# Altium project ECAD_Clock.PrjPcb
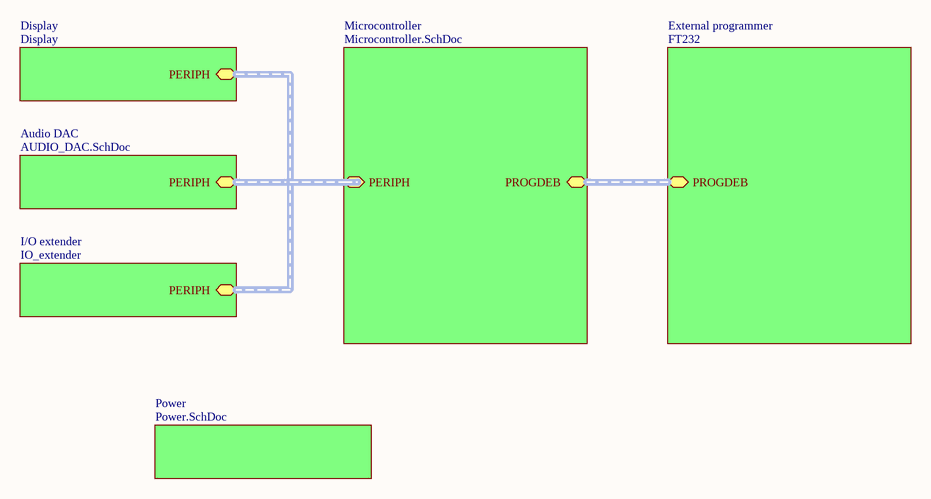
[diagram p0: Top level overview.SchDoc]
7 sheets, 117 parts. Net scope: hierarchical (ports join the sheet entries above them; power ports are global).
Board file: ECAD_Clock.PcbDoc
Sheets:
  Top level overview.SchDoc
    Microcontroller = Microcontroller.SchDoc
    External programmer = FT232.SchDoc
    Display = Display.SchDoc
    Audio DAC = AUDIO_DAC.SchDoc
    I/O extender = IO_extender.SchDoc
    Power = Power.SchDoc

## Sheet Top level overview.SchDoc
size A4

### Sub-sheets
Audio DAC = AUDIO_DAC.SchDoc: PERIPH (harness PERIPH)
Display = Display: PERIPH (harness PERIPH)
External programmer = FT232: PROGDEB (harness PROGDEB)
I/O extender = IO_extender: PERIPH (harness PERIPH)
Microcontroller = Microcontroller.SchDoc: PROGDEB (harness PROGDEB), PERIPH (harness PERIPH)
Power = Power.SchDoc: no entries

### Buses and harness runs
harness sheet Audio DAC/PERIPH = sheet Display/PERIPH = sheet I/O extender/PERIPH = sheet Microcontroller/PERIPH
harness sheet External programmer/PROGDEB = sheet Microcontroller/PROGDEB

## Sheet Microcontroller.SchDoc
size A4
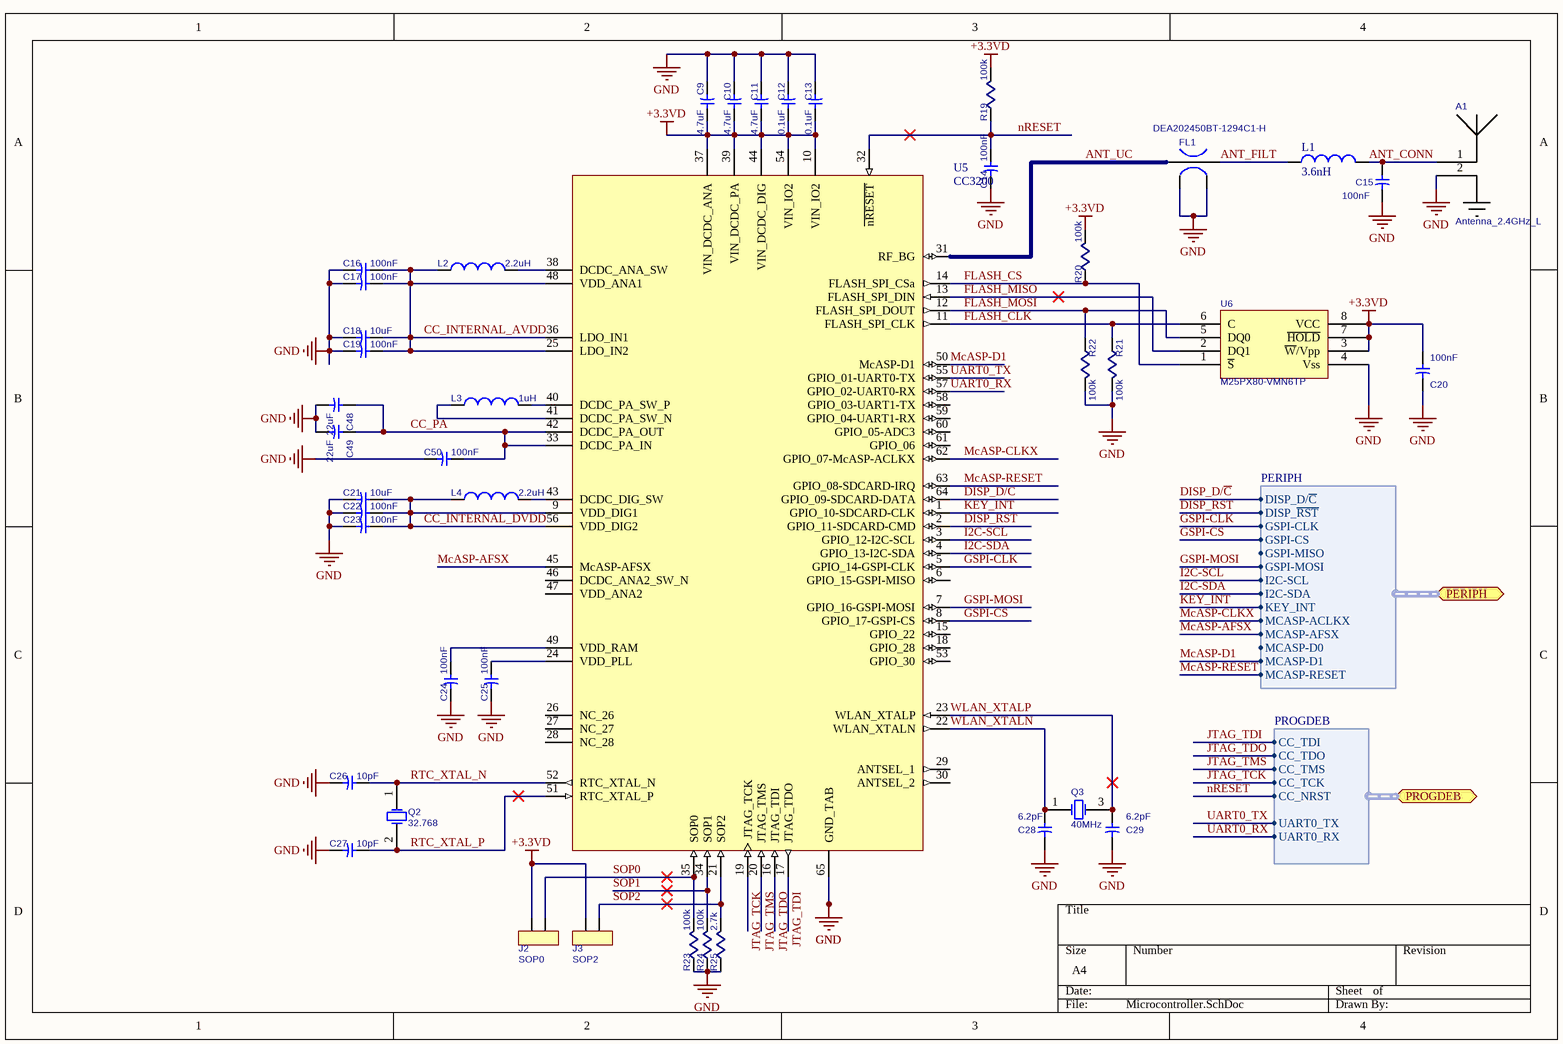
[diagram p1: Microcontroller.SchDoc]

### Parts
A1  Antenna_2.4GHz_L  [Antenna_2.45GHz_IFA1_L]  (net tie, no BOM)
C9  4.7uF  [C_0603A]
C10  4.7uF  [C_0603A]
C11  4.7uF  [C_0603A]
C12  0.1uF  [C_0603A]
C13  0.1uF  [C_0603A]
C14  100nF  [C_0603A]
C15  100nF  [C_0603A]
C16  100nF  [C_0603A]
C17  100nF  [C_0603A]
C18  10uF  [C_0603A]
C19  100nF  [C_0603A]
C20  100nF  [C_0603A]
C21  10uF  [C_0603A]
C22  100nF  [C_0603A]
C23  100nF  [C_0603A]
C24  100nF  [C_0603A]
C25  100nF  [C_0603A]
C26  10pF  [C_0603A]
C27  10pF  [C_0603A]
C28  6.2pF  [C_0603A]
C29  6.2pF  [C_0603A]
C48  22uF  [C_1210D]
C49  22uF  [C_1210D]
C50  100nF  [C_0603A]
FL1  DEA202450BT-1294C1-H  [DEA202450BT-1294C1-H]
J2  SOP0  [JUMPER100]
J3  SOP2  [JUMPER100]
L1  3.6nH  [0402-A]
L2  2.2uH  [L_1008]
L3  1uH  [L_1008]
L4  2.2uH  [L_1008]
Q2  32.768  [Q_FC135]
Q3  40MHz  [SM/25X20/CMOS_CLK_4]
R19  100k  [R_0603]
R20  100k  [R_0603]
R21  100k  [R_0603]
R22  100k  [R_0603]
R23  100k  [R_0603]
R24  100k  [R_0603]
R25  2.7k  [R_0603]
U5  CC3200  [PQFN50P900X900X100_HS-65N]
U6  M25PX80-VMN6TP  [SOG.050/8/WG.244/L.175]

### Ports
PERIPH (harness PERIPH), PROGDEB (harness PROGDEB)

### Harnesses
PROGDEB: CC_TDI, CC_TDO, CC_TCK, CC_TMS, CC_NRST, UART0_TX, UART0_RX
PERIPH: DISP_D/~{C}, DISP_~{RST}, GSPI-CLK, GSPI-CS, GSPI-MISO, GSPI-MOSI, I2C-SCL, I2C-SDA, KEY_INT, MCASP-ACLKX, MCASP-AFSX, MCASP-D0, MCASP-D1, MCASP-RESET

### Nets
+3.3VD: C9.1 C10.1 C11.1 C12.1 C13.1 C20.1 J2.1 J3.1 R19.1 R20.1 U5.10(VIN_IO2) U5.37(VIN_DCDC_ANA) U5.39(VIN_DCDC_PA) U5.44(VIN_DCDC_DIG) U5.54(VIN_IO2) U6.3(~{W}/Vpp) U6.7(~{HOLD}) U6.8(VCC)  [project net IOVDD]
GND: A1.2 C9.2 C10.2 C11.2 C12.2 C13.2 C14.2 C15.2 C16.2 C17.2 C18.2 C19.2 C20.2 C21.2 C22.2 C23.2 C24.2 C25.2 C26.2 C27.2 C28.2 C29.2 C48.2 C49.2 C50.2 FL1.2 FL1.4 Q3.2(GND) Q3.4(GND) R21.1 R22.1 R23.2 R24.2 R25.2 U5.65(GND_TAB) U6.4(Vss)
ANT_CONN: A1.1 C15.1 L1.2
ANT_FILT: FL1.3 L1.1
ANT_UC: FL1.1 U5.31(RF_BG)
CC_INTERNAL_AVDD: C16.1 C17.1 C18.1 C19.1 L2.1 U5.25(LDO_IN2) U5.36(LDO_IN1) U5.48(VDD_ANA1)
CC_INTERNAL_DVDD: C21.1 C22.1 C23.1 L4.1 U5.9(VDD_DIG1) U5.56(VDD_DIG2)
CC_PA: C48.1 C49.1 C50.1 U5.33(DCDC_PA_IN) U5.42(DCDC_PA_OUT)
DISP_D/~{C}: U5.64(GPIO_09-SDCARD-DATA) ; port PERIPH.DISP_D/~{C}
DISP_RST: U5.2(GPIO_11-SDCARD-CMD) ; port PERIPH.DISP_~{RST}  [project net DISP_~{RST}]
FLASH_CLK: R21.2 U5.11(FLASH_SPI_CLK) U6.6(C)
FLASH_CS: R20.2 U5.14(FLASH_SPI_CSa) U6.1(~{S})
FLASH_MISO: U5.13(FLASH_SPI_DIN) U6.2(DQ1)
FLASH_MOSI: R22.2 U5.12(FLASH_SPI_DOUT) U6.5(DQ0)
GSPI-CLK: U5.5(GPIO_14-GSPI-CLK) ; port PERIPH.GSPI-CLK
GSPI-CS: U5.8(GPIO_17-GSPI-CS) ; port PERIPH.GSPI-CS
GSPI-MOSI: U5.7(GPIO_16-GSPI-MOSI) ; port PERIPH.GSPI-MOSI
I2C-SCL: U5.3(GPIO_12-I2C-SCL) ; port PERIPH.I2C-SCL
I2C-SDA: U5.4(GPIO_13-I2C-SDA) ; port PERIPH.I2C-SDA
JTAG_TCK: U5.19(JTAG_TCK) ; port PROGDEB.CC_TCK  [project net CC_TCK]
JTAG_TDI: U5.17(JTAG_TDO) ; port PROGDEB.CC_TDI  [project net CC_TDI]
JTAG_TDO: U5.16(JTAG_TDI) ; port PROGDEB.CC_TDO  [project net CC_TDO]
JTAG_TMS: U5.20(JTAG_TMS) ; port PROGDEB.CC_TMS  [project net CC_TMS]
KEY_INT: U5.1(GPIO_10-SDCARD-CLK) ; port PERIPH.KEY_INT
McASP-AFSX: U5.45(McASP-AFSX) ; port PERIPH.MCASP-AFSX
McASP-CLKX: U5.62(GPIO_07-McASP-ACLKX) ; port PERIPH.MCASP-ACLKX  [project net McASP-ACLKX]
McASP-D1: U5.50(McASP-D1) ; port PERIPH.MCASP-D1
McASP-RESET: U5.63(GPIO_08-SDCARD-IRQ) ; port PERIPH.MCASP-RESET
nRESET: C14.1 R19.2 U5.32(~{nRESET}) ; port PROGDEB.CC_NRST  [project net CC_NRST]
RTC_XTAL_N: C26.1 Q2.1(X1) U5.52(RTC_XTAL_N)
RTC_XTAL_P: C27.1 Q2.2(X2) U5.51(RTC_XTAL_P)
SOP0: J2.2 R23.1 U5.35(SOP0)
SOP1: R24.1 U5.34(SOP1)
SOP2: J3.2 R25.1 U5.21(SOP2)
UART0_RX: U5.57(GPIO_02-UART0-RX) ; port PROGDEB.UART0_RX
UART0_TX: U5.55(GPIO_01-UART0-TX) ; port PROGDEB.UART0_TX
WLAN_XTALN: C28.1 Q3.1(X1) U5.22(WLAN_XTALN)
WLAN_XTALP: C29.1 Q3.3(X2) U5.23(WLAN_XTALP)
NetC24_1: C24.1 U5.49(VDD_RAM)
NetC25_1: C25.1 U5.24(VDD_PLL)
NetL2_2: L2.2 U5.38(DCDC_ANA_SW)
NetL3_1: L3.1 U5.41(DCDC_PA_SW_N)
NetL3_2: L3.2 U5.40(DCDC_PA_SW_P)
NetL4_2: L4.2 U5.43(DCDC_DIG_SW)

Not connected (* = marked no-connect by the designer): U5 6(GPIO_15-GSPI-MISO) 15(GPIO_22) 18(GPIO_28) 26(NC_26) 27(NC_27) 28(NC_28) 29(ANTSEL_1) 30(ANTSEL_2) 46(DCDC_ANA2_SW_N) 47(VDD_ANA2) 53(GPIO_30) 58(GPIO_03-UART1-TX) 59(GPIO_04-UART1-RX) 60(GPIO_05-ADC3) 61(GPIO_06)

### Library data of the parts
C9-C29 C50 = C_0603: PackageReference: C_0603
  C9-C11: VALUE: 4.7uF
  C12 C13: VALUE: 0.1uF
  C14-C17 C19 C20 C22-C25 C50: VALUE: 100nF
  C18 C21: VALUE: 10uF
  C26 C27: VALUE: 10pF
  C28 C29: VALUE: 6.2pF
C48 C49 = C_1210: PackageReference: C_1210; VALUE: 22uF
FL1 = DEA202450BT-1294C1-H: 2.45 GHz filter; Manufacturer: TDK Corporation; Filter Type: Band Pass; Bandwidth: 72MHz; Insertion Loss: 1.35dB; Frequency: 2.45GHz Center; Part Status: Active; Size / Dimension: 0.079" L x 0.053" W (2.00mm x 1.35mm); Supplier Part Number 1: 445-172335-1-ND; Mounting Type: Surface Mount; Package / Case: 0805 (2012 Metric); Supplier 1: Digi-Key; Category: Filters; Manufacturer Part Number: DEA202450BT-1294C1-H; Height (Max): 0.032" (0.80mm); Packaging: Cut Tape (CT); Ripple: -; RoHS: RoHS Compliant
J2 J3 = JUMPER_100: Jumper 2.54 mm
L1 = Inductor: Code_IEC: 1005; Published: 8-Jun-2000; LatestRevisionDate: 29-May-2009; LatestRevisionNote: IPC-7351 Footprint Added.; PackageReference: 0402-A; Publisher: Altium Limited; PackageDescription: Chip Inductor; Code_JEITA: 0402; Value: 3.6nH
L2-L4 = L_1008: Manufacturer Part Number: LQM2HPN2R2MG0L; Manufacturer: Murata Electronics North America; Inductance: 2.2µH; Shielding: Shielded; Frequency - Self Resonant: 40MHz; Type: Multilayer; Frequency - Test: 1MHz; Tolerance: ±20%; Material - Core: Ferrite; Current Rating: 1.3A; DC Resistance (DCR): 100 mOhm Max; RoHS: RoHS Compliant; ComponentLink1URL: http://www.farnell.com/datasheets/1888687.pdf; ComponentLink1Description: http://www.farnell.com/datasheets/1888687.pdf; Supplier Part Number 1: 490-5114-1-ND; Category: Inductors, Coils, Chokes; Height - Seated (Max): 0.039" (1.00mm); Q @ Freq: -; Package / Case: 1008 (2520 Metric); Packaging: Cut Tape (CT); Supplier 1: Digi-Key; Operating Temperature: -55°C ~ 125°C; Current - Saturation: -; Part Status: Active; Ratings: -; Mounting Type: Surface Mount; Size / Dimension: 0.098" L x 0.079" W (2.50mm x 2.00mm); ComponentLink2URL: http://search.murata.co.jp/Ceramy/image/img/PDF/ENG/L0075S0104LQM2HP_G0.pdf; ComponentLink2Description: http://search.murata.co.jp/Ceramy/image/img/PDF/ENG/L0075S0104LQM2HP_G0.pdf
Q2 = QUARTZ_3.2x1.5: Manufacturer Part Number: Q13FC13500003 FC-135 32.768KHZ 9.0PF; Manufacturer: EPSON; Frequency Tolerance + / -: 20; Product Range: FC-135 Series; Load Capacitance: 9; Crystal Case: SMD, 3.2mm x 1.5; Supplier 1: Farnell; Frequency Stability + / -: -; Operating Temperature Max: 85; Packaging: Cut Tape<!--FANDB--><div class="features-and-benefits-container"></div>; RoHS: YES; Frequency Nom: 32.768; Operating Temperature Min: -40; Supplier Part Number 1: 1278037; ComponentLink1Description: http://www.farnell.com/datasheets/1678503.pdf; ComponentLink1URL: http://www.farnell.com/datasheets/1678503.pdf
Q3 = QUARTZ_3.2x2.5: Manufacturer Part Number: Q24FA20H00396  FA-20H 40MHZ 8PF; Manufacturer: EPSON; Load Capacitance: 8; Frequency Nom: 40; Crystal Case: SMD, 2.5mm x 2; Supplier Part Number 1: 2471840; Supplier 1: Farnell; ComponentLink1URL: http://www.farnell.com/datasheets/1897374.pdf; ComponentLink1Description: http://www.farnell.com/datasheets/1897374.pdf
R19-R25 = R_0603: PackageReference: R_0603
  R19-R24: VALUE: 100k
  R25: VALUE: 2.7k
U5 = CC3200: CC3200 Single-Chip Wireless MCU
U6 = M25PX80-VMN6TP: Serial Flash; Manufacturer: Micron Technology Inc.; Manufacturer Part Number: M25PX80-VMN6TP TR; Speed: 75MHz; Voltage - Supply: 2.3 V ~ 3.6 V; Memory Size: 8M (1M x 8); Memory Type: FLASH - NOR; Interface: SPI Serial; Category: Integrated Circuits (ICs); Part Status: Active; Operating Temperature: -40°C ~ 85°C (TA); Package / Case: 8-SOIC (0.154", 3.90mm Width); Supplier Device Package: 8-SO; Packaging: Cut Tape (CT); Format - Memory: FLASH; Supplier 1: Digi-Key; RoHS: RoHS Compliant; ComponentLink1URL: http://www.micron.com/~/media/Documents/Products/Data%20Sheet/NOR%20Flash/Serial%20NOR/M25PX/M25PX_80.pdf; ComponentLink1Description: http://www.micron.com/~/media/Documents/Products/Data%20Sheet/NOR%20Flash/Serial%20NOR/M25PX/M25PX_80.pdf; Supplier Part Number 1: M25PX80-VMN6TP CT-ND

## Sheet FT232.SchDoc
size A4
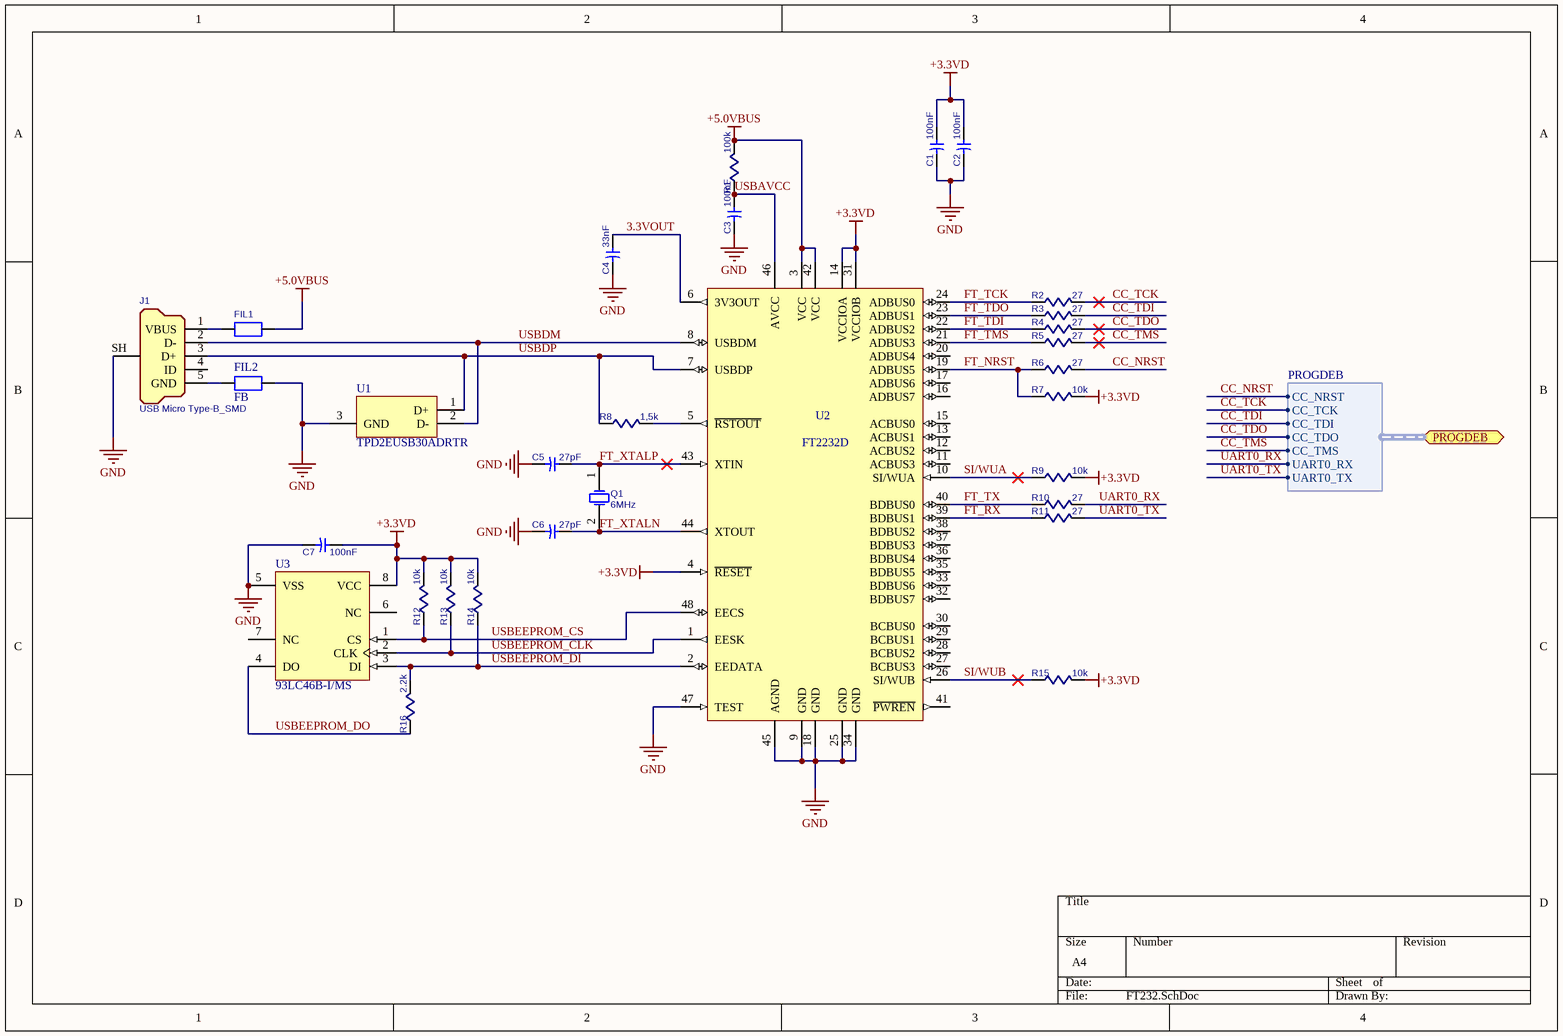
[diagram p2: FT232.SchDoc]

### Parts
C1  100nF  [C_0603A]
C2  100nF  [C_0603A]
C3  100nF  [C_0603A]
C4  33nF  [C_0603A]
C5  27pF  [C_0603A]
C6  27pF  [C_0603A]
C7  100nF  [C_0603A]
FIL1  FB  [FB_0603]  (value not drawn)
FIL2  FB  [FB_0603]
J1  USB Micro Type-B_SMD  [MICRO USB TYPE-B_SMD]
Q1  6MHz  [QUARTZ_10x4.5]
R1  100k  [R_0603]
R2  27  [R_0603]
R3  27  [R_0603]
R4  27  [R_0603]
R5  27  [R_0603]
R6  27  [R_0603]
R7  10k  [R_0603]
R8  1,5k  [R_0603]
R9  10k  [R_0603]
R10  27  [R_0603]
R11  27  [R_0603]
R12  10k  [R_0603]
R13  10k  [R_0603]
R14  10k  [R_0603]
R15  10k  [R_0603]
R16  2.2k  [R_0603]
U1  TPD2EUSB30ADRTR  [DRT0003A]
U2  FT2232D  [LQFP-48_N]
U3  93LC46B-I/MS  [MSOP-MS8_N]

### Ports
PROGDEB (harness PROGDEB)

### Harnesses
PROGDEB: CC_NRST, CC_TCK, CC_TDI, CC_TDO, CC_TMS, UART0_RX, UART0_TX

### Nets
+3.3VD: C1.1 C2.1 C7.1 R7.1 R9.1 R12.1 R13.1 R14.1 R15.1 U2.4(~{RESET}) U2.14(VCCIOA) U2.31(VCCIOB) U3.8(VCC)  [project net IOVDD]
+5.0VBUS: FIL1.1 R1.1 U2.3(VCC) U2.42(VCC)
GND: C1.2 C2.2 C3.2 C4.2 C5.2 C6.2 C7.2 FIL2.1 J1.SH(Shell) U1.3(GND) U2.9(GND) U2.18(GND) U2.25(GND) U2.34(GND) U2.45(AGND) U2.47(TEST) U3.5(VSS)
3.3VOUT: C4.1 U2.6(3V3OUT)
CC_NRST: R6.1 ; port PROGDEB.CC_NRST
CC_TCK: R2.1 ; port PROGDEB.CC_TCK
CC_TDI: R3.1 ; port PROGDEB.CC_TDI
CC_TDO: R4.1 ; port PROGDEB.CC_TDO
CC_TMS: R5.1 ; port PROGDEB.CC_TMS
FT_NRST: R6.2 R7.2 U2.19(ADBUS5)
FT_RX: R11.2 U2.39(BDBUS1)
FT_TCK: R2.2 U2.24(ADBUS0)
FT_TDI: R4.2 U2.22(ADBUS2)
FT_TDO: R3.2 U2.23(ADBUS1)
FT_TMS: R5.2 U2.21(ADBUS3)
FT_TX: R10.2 U2.40(BDBUS0)
FT_XTALN: C6.1 Q1.2(X2) U2.44(XTOUT)
FT_XTALP: C5.1 Q1.1(X1) U2.43(XTIN)
SI/WUA: R9.2 U2.10(SI/WUA)
SI/WUB: R15.2 U2.26(SI/WUB)
UART0_RX: R10.1 ; port PROGDEB.UART0_RX
UART0_TX: R11.1 ; port PROGDEB.UART0_TX
USBAVCC: C3.1 R1.2 U2.46(AVCC)
USBDM: J1.2(D-) U1.2(D-) U2.8(USBDM)
USBDP: J1.3(D+) R8.2 U1.1(D+) U2.7(USBDP)
USBEEPROM_CLK: R13.2 U2.1(EESK) U3.2(CLK)
USBEEPROM_CS: R12.2 U2.48(EECS) U3.1(CS)
USBEEPROM_DI: R14.2 R16.1 U2.2(EEDATA) U3.3(DI)
USBEEPROM_DO: R16.2 U3.4(DO)
NetFIL1_2: FIL1.2 J1.1(VBUS)
NetFIL2_2: FIL2.2 J1.5(GND)
NetR8_1: R8.1 U2.5(~{RSTOUT})

Not connected (* = marked no-connect by the designer): J1 4(ID); U2 11(ACBUS3) 12(ACBUS2) 13(ACBUS1) 15(ACBUS0) 16(ADBUS7) 17(ADBUS6) 20(ADBUS4) 27(BCBUS3) 28(BCBUS2) 29(BCBUS1) 30(BCBUS0) 32(BDBUS7) 33(BDBUS6) 35(BDBUS5) 36(BDBUS4) 37(BDBUS3) 38(BDBUS2) 41(~{PWREN}); U3 6(NC) 7(NC)

### Library data of the parts
C1-C7 = C_0603: PackageReference: C_0603
  C1-C3 C7: VALUE: 100nF
  C4: VALUE: 33nF
  C5 C6: VALUE: 27pF
FIL1 FIL2 = FB_0603: Manufacturer Part Number: MPZ1608S221ATA00; Manufacturer: TDK Corporation; Current Rating: 2.2A; Impedance: 220 Ohm; DC Resistance (DCR) (Max): 50 mOhm; Filter Type: Power Line; Number of Lines: 1; Impedance @ Frequency: 220 Ohm @ 100MHz; Ratings: -; Package / Case: 0603 (1608 Metric); Part Status: Active; Current Rating (Max): 2.2A; Packaging: Cut Tape (CT); Operating Temperature: -55°C ~ 125°C; Mounting Type: Surface Mount; Height (Max): 0.037" (0.95mm); Size / Dimension: 0.063" L x 0.031" W (1.60mm x 0.80mm); RoHS: RoHS Compliant; Supplier 1: Digi-Key; Category: Filters; ComponentLink1URL: https://product.tdk.com/info/en/catalog/datasheets/beads_commercial_power_mpz1608_en.pdf; ComponentLink1Description: https://product.tdk.com/info/en/catalog/datasheets/beads_commercial_power_mpz1608_en.pdf; Supplier Part Number 1: 445-1565-1-ND
J1 = USB Micro Type-B_SMD: USB Micro Type-B; Manufacturer: Amphenol FCI; Manufacturer Part Number: 10118192-0001LF; Gender: Receptacle; Number of Contacts: 5; Connector Type: USB - micro B; Specifications: USB 2.0; Supplier 1: Digi-Key; URL: http://www.te.com/commerce/DocumentDelivery/DDEController?Action=srchrtrv&DocNm=2174507&DocType=Customer+Drawing&DocLang=JP; Category: Connectors, Interconnects; Packaging: Cut Tape (CT); Part Status: Active; RoHS: RoHS Compliant; Mounting Type: Surface Mount, Right Angle, Horizontal; Ingress Protection: -; Features: Flange, Shielded; ComponentLink1URL: http://portal.fciconnect.com/Comergent//fci/drawing/10118192.pdf; ComponentLink1Description: http://portal.fciconnect.com/Comergent//fci/drawing/10118192.pdf; Supplier Part Number 1: 609-4613-1-ND
Q1 = QUARTZ_10x4.5mm: Manufacturer Part Number: FQ1045A-6.000; Manufacturer: Fox Electronics; Frequency Tolerance + / -: 20; Product Range: FC-135 Series; Frequency Nom: 32.768; Load Capacitance: 20pF; Crystal Case: SMD, 3.2mm x 1.5; Type: MHz Crystal; Frequency Stability: ±30ppm; ESR (Equivalent Series Resistance): 150 Ohm; Operating Mode: Fundamental; Supplier 1: Digi-Key; Frequency Stability + / -: -; Operating Temperature Max: 85; Packaging: Cut Tape (CT); RoHS: RoHS Compliant; Operating Temperature Min: -40; Supplier Part Number 1: 631-1035-1-ND; ComponentLink1Description: http://www.farnell.com/datasheets/1678503.pdf; ComponentLink1URL: http://www.farnell.com/datasheets/1678503.pdf; Category: Crystals and Oscillators; Part Status: Active; Frequency: 6MHz; Frequency Tolerance: ±30ppm; Operating Temperature: 0°C ~ 70°C; Ratings: -; Mounting Type: Surface Mount; Package / Case: 2-SMD; Size / Dimension: 0.394" L x 0.177" W (10.00mm x 4.50mm); Height: 0.067" (1.70mm); ComponentLink2URL: http://foxonline.com/pdfs/fq1045a.pdf; ComponentLink2Description: http://foxonline.com/pdfs/fq1045a.pdf
R1-R16 = R_0603: PackageReference: R_0603
  R1: VALUE: 100k
  R2-R6 R10 R11: VALUE: 27
  R7 R9 R12-R15: VALUE: 10k
  R8: VALUE: 1,5k
  R16: VALUE: 2.2k
U1 = CMP-0326-00047-3: ESD / Surge Solution for High Speed, Low Voltage Interface, 2 Channels, -40 to +85 degC, 3-pin SOT (DRT), Green (RoHS & no Sb/Br); Manufacturer: Texas Instruments; IEC 61000-4-2 Air-Gap(+/- kV): 8; SubFamily: ESD Solution; 1394 / Firewire: TRUE; IO Leakage Current(nA): 10; Differential Capacitance(pF): 0.05; Breakdown Voltage(Min)(V): 4.5; IO Capacitance(Typ)(pF): 0.7; Mounting Technology: Surface Mount; PartNumber: TPD2EUSB30ADRTR; ComponentLink2URL: SamplesURL:http://www.ti.com/product/tpd2eusb30a#samples; IEC 61000-4-2 Contact(+/- kV): 8; PackageReference: DRT0003A; Eco-Plan: Green (RoHS & no Sb/Br); ComponentLink2Description: URL Link1; USB Full Speed: TRUE; USB High Speed: TRUE; PackageDescription: 3-Flat Lead Plastic Small Outline, 1 x 1 mm (inc leads), 0.35 mm Pitch; Serial ATA / eSATA: TRUE; ComponentLink1URL: http://www.ti.com/general/docs/lit/getliterature.tsp?genericPartNumber=TPD2EUSB30A&fileType=pdf; DatasheetVersion: SLVSAC2C; PackageVersion: revD, Jun-2008; ComponentLink1Description: Datasheet; HDMI: TRUE; USB Super Speed: TRUE
U2 = CMP-0078-00017-3: FT2232D Dual USB to Serial UART/FIFO IC, -40 to +85 degC, 48-pin LQFP; Manufacturer: FTDI; ComponentLink1URL: http://www.ftdichip.com/; PackageDescription: 48-Pin Thin Quad Flat Pack, 7 x 7 mm Body, 0.5 mm Pitch; PackageVersion: Apr-11; ComponentLink2URL: http://www.ftdichip.com/Support/Documents/DataSheets/ICs/DS_FT2232D.pdf; PartNumber: FT2232D; ComponentLink2Description: Datasheet; DatasheetVersion: ver 2.05, Apr-2011; ComponentLink1Description: Manufacturer URL; PackageReference: LQFP-48
U3 = CMP-0162-00461-1: 1K, 64x16-bit, 2.5V Microwire Serial EEPROM, 8-Pin MSOP, Industrial Temperature; PackageReference: MSOP-MS8; PackageDescription: 8-Lead Plastic Micro Small Outline Package (MS) [MSOP]; PackageVersion: revBB, Aug-2009; DatasheetVersion: revG, May-2008

## Sheet Display.SchDoc
size A4
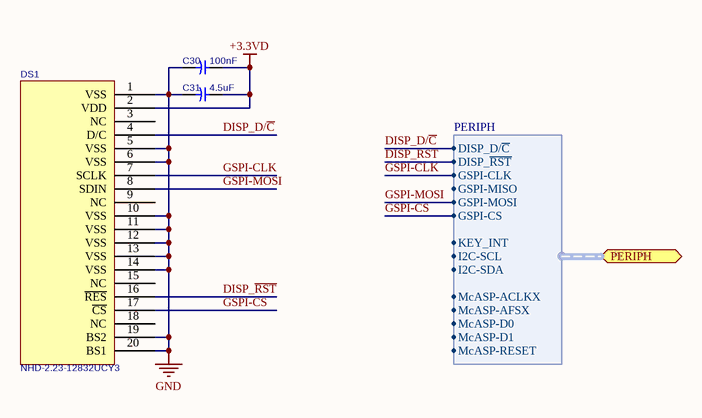
[diagram p3: Display.SchDoc]

### Parts
C30  100nF  [C_0603A]
C31  4.5uF  [C_0603A]
DS1  NHD-2.23-12832UCY3  [NHD-2.23-12832UCY3_FP]

### Ports
PERIPH (harness PERIPH)

### Harnesses
PERIPH: DISP_D/~{C}, DISP_~{RST}, GSPI-CLK, GSPI-MISO, GSPI-MOSI, GSPI-CS, KEY_INT, I2C-SCL, I2C-SDA, McASP-ACLKX, McASP-AFSX, McASP-D0, McASP-D1, McASP-RESET

### Nets
+3.3VD: C30.1 C31.1 DS1.2(VDD)  [project net IOVDD]
GND: C30.2 C31.2 DS1.1(VSS) DS1.5(VSS) DS1.6(VSS) DS1.10(VSS) DS1.11(VSS) DS1.12(VSS) DS1.13(VSS) DS1.14(VSS) DS1.19(BS2) DS1.20(BS1)
DISP_D/~{C}: DS1.4(D/C) ; port PERIPH.DISP_D/~{C}
DISP_~{RST}: DS1.16(~{RES}) ; port PERIPH.DISP_~{RST}
GSPI-CLK: DS1.7(SCLK) ; port PERIPH.GSPI-CLK
GSPI-CS: DS1.17(~{CS}) ; port PERIPH.GSPI-CS
GSPI-MOSI: DS1.8(SDIN) ; port PERIPH.GSPI-MOSI

Not connected (* = marked no-connect by the designer): DS1 3(NC) 9(NC) 15(NC) 18(NC)

### Library data of the parts
C30 C31 = C_0603: PackageReference: C_0603
  C30: VALUE: 100nF
  C31: VALUE: 4.5uF
DS1 = NHD-2.23-12832UCY3: OLED DISPLAY; Manufacturer: Newhaven Display Intl; Background Color: Black; Graphics Color: Yellow; Dot Size: 0.41mm W x 0.39mm H; Diagonal Screen Size: 2.23" (56.64mm); Display Type: OLED - Passive Matrix; Viewing Area: 60.00mm W x 18.00mm H; Backlight: Without Backlight; Dot Pixels: 128 x 32; Interface: I²C, Parallel 8-Bit, SPI; Dot Pitch: 0.43mm W x 0.41mm H; Part Status: Active; Supplier 1: Digi-Key; Display Mode: -; Category: Optoelectronics; Manufacturer Part Number: NHD-2.23-12832UCY3; Touchscreen: -; RoHS: RoHS Compliant; ComponentLink1URL: http://www.newhavendisplay.com/specs/NHD-2.23-12832UCY3.pdf; ComponentLink1Description: http://www.newhavendisplay.com/specs/NHD-2.23-12832UCY3.pdf; Supplier Part Number 1: NHD-2.23-12832UCY3-ND

## Sheet AUDIO_DAC.SchDoc
size A4
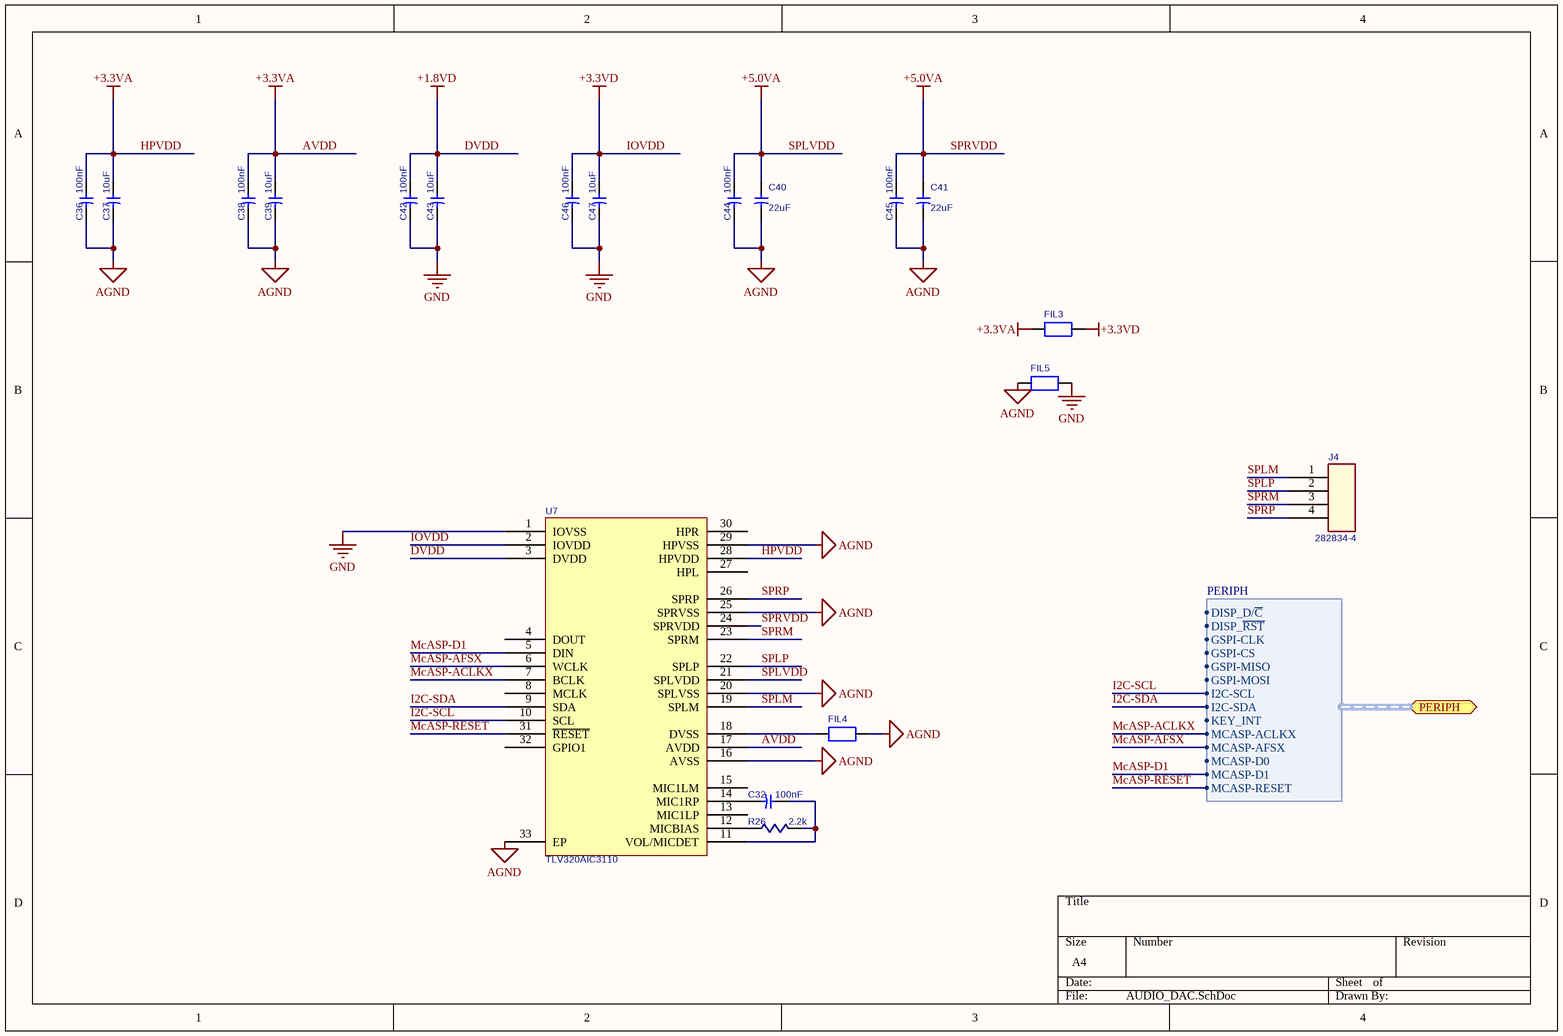
[diagram p4: AUDIO_DAC.SchDoc]

### Parts
C32  100nF  [C_0603A]
C36  100nF  [C_0603A]
C37  10uF  [C_0603A]
C38  100nF  [C_0603A]
C39  10uF  [C_0603A]
C40  22uF  [C_1210D]
C41  22uF  [C_1210D]
C42  100nF  [C_0603A]
C43  10uF  [C_0603A]
C44  100nF  [C_0603A]
C45  100nF  [C_0603A]
C46  100nF  [C_0603A]
C47  10uF  [C_0603A]
FIL3  FB  [FB_0603]  (value not drawn)
FIL4  FB  [FB_0603]  (value not drawn)
FIL5  FB  [FB_0603]  (value not drawn)
J4  282834-4  [HEADER_2.54_SCREW_4PIN]
R26  2.2k  [R_0603]
U7  TLV320AIC3110  [QFN50P500X500X80-32N]

### Ports
PERIPH (harness PERIPH)

### Harnesses
PERIPH: DISP_D/~{C}, DISP_~{RST}, GSPI-CLK, GSPI-CS, GSPI-MISO, GSPI-MOSI, I2C-SCL, I2C-SDA, KEY_INT, MCASP-ACLKX, MCASP-AFSX, MCASP-D0, MCASP-D1, MCASP-RESET

### Nets
AGND: C36.2 C37.2 C38.2 C39.2 C40.2 C41.2 C44.2 C45.2 FIL4.1 FIL5.2 U7.16(AVSS) U7.20(SPLVSS) U7.25(SPRVSS) U7.29(HPVSS) U7.33(EP)
AVDD: C36.1 C37.1 C38.1 C39.1 FIL3.2 U7.17(AVDD) U7.28(HPVDD)  [also labelled +3.3VA, HPVDD]
DVDD: C42.1 C43.1 U7.3(DVDD)  [also labelled +1.8VD]
GND: C42.2 C43.2 C46.2 C47.2 FIL5.1 U7.1(IOVSS)
IOVDD: C46.1 C47.1 FIL3.1 U7.2(IOVDD)  [also labelled +3.3VD]
SPLVDD: C40.1 C41.1 C44.1 C45.1 U7.21(SPLVDD) U7.24(SPRVDD)  [also labelled +5.0VA, SPRVDD]
I2C-SCL: U7.10(SCL) ; port PERIPH.I2C-SCL
I2C-SDA: U7.9(SDA) ; port PERIPH.I2C-SDA
McASP-ACLKX: U7.7(BCLK) ; port PERIPH.MCASP-ACLKX
McASP-AFSX: U7.6(WCLK) ; port PERIPH.MCASP-AFSX
McASP-D1: U7.5(DIN) ; port PERIPH.MCASP-D1
McASP-RESET: U7.31(~{RESET}) ; port PERIPH.MCASP-RESET
SPLM: J4.1 U7.19(SPLM)
SPLP: J4.2 U7.22(SPLP)
SPRM: J4.3 U7.23(SPRM)
SPRP: J4.4 U7.26(SPRP)
NetC32_1: C32.1 R26.1 U7.11(VOL/MICDET)
NetC32_2: C32.2 U7.14(MIC1RP)
NetFIL4_2: FIL4.2 U7.18(DVSS)
NetR26_2: R26.2 U7.12(MICBIAS)

Not connected (* = marked no-connect by the designer): U7 4(DOUT) 8(MCLK) 13(MIC1LP) 15(MIC1LM) 27(HPL) 30(HPR) 32(GPIO1)

### Library data of the parts
C32 C36-C39 C42-C47 = C_0603: PackageReference: C_0603
  C32 C36 C38 C42 C44-C46: VALUE: 100nF
  C37 C39 C43 C47: VALUE: 10uF
C40 C41 = C_1210: PackageReference: C_1210; VALUE: 22uF
FIL3-FIL5 = FB_0603: as FIL1 on sheet FT232; Ratings: -; Package / Case: 0603 (1608 Metric); Part Status: Active; Current Rating (Max): 2.2A; Packaging: Cut Tape (CT); Operating Temperature: -55°C ~ 125°C; Mounting Type: Surface Mount; Height (Max): 0.037" (0.95mm); Size / Dimension: 0.063" L x 0.031" W (1.60mm x 0.80mm); RoHS: RoHS Compliant; Supplier 1: Digi-Key; Category: Filters; ComponentLink1URL: https://product.tdk.com/info/en/catalog/datasheets/beads_commercial_power_mpz1608_en.pdf; ComponentLink1Description: https://product.tdk.com/info/en/catalog/datasheets/beads_commercial_power_mpz1608_en.pdf; Supplier Part Number 1: 445-1565-1-ND
J4 = TERM_LIST_4: Manufacturer: TE CONNECTIVITY / BUCHANAN; Wire Size AWG Min: 30; Rated Voltage: 150; No. of Positions: 4; Connector Type: Terminal Block, Eurostyle; Conductor Area CSA: 1.4; Connector Mounting: PCB Mount; Wire Size AWG Max: 16; Wire Connection Method: Screw; Rated Current: 10; Block Orientation: Through Hole Right Angle; Pitch Spacing: 2.54; Supplier 1: Farnell; Contact Material: Brass; Contact Plating: Tin Plated Contacts<!--FANDB--><div class="features-and-benefits-container"><div class="features-and-benefits-description"><span class="features-benefits-value">The 282834-4 is a 4-position 1-row green through-hole right-angle Terminal Block with tin-plated brass contacts and polyamide 6.6 housing. The BUCHANAN terminal block with special rising cage clamp design allows numerous reliable connections and disconnections at field installations. The housing funnel entry design enables an easier product application.</span></div><div class="features-and-benefits-list"><ul class="features-and-benefits-list-list"><li class="features-and-benefits-list-item">IR Reflow compatible</li><li class="features-and-benefits-list-item">-40 to +105; Manufacturer Part Number: 282834-4; Product Range: -; RoHS: YES; ComponentLink1URL: http://www.farnell.com/cad/1605505.pdf; ComponentLink1Description: http://www.farnell.com/cad/1605505.pdf; ComponentLink2URL: http://www.farnell.com/datasheets/1650926.pdf; ComponentLink2Description: http://www.farnell.com/datasheets/1650926.pdf; ComponentLink3URL: http://www.farnell.com/datasheets/504548.pdf; ComponentLink3Description: http://www.farnell.com/datasheets/504548.pdf; Supplier Part Number 1: 2396253
R26 = R_0603: PackageReference: R_0603; VALUE: 2.2k
U7 = TLV320AIC3110: Manufacturer: Texas Instruments; Manufacturer Part Number: TLV320AIC3110IRHBR; Sigma Delta: Yes; Voltage - Supply, Digital: 1.65 V ~ 1.95 V; Data Interface: I²C, Serial; Voltage - Supply, Analog: 2.7 V ~ 3.6 V; Number of ADCs / DACs: 1 / 2; S/N Ratio, ADCs / DACs (db) Typ: 91 / 95; Resolution (Bits): 32 b; Mounting Type: Surface Mount; Category: Integrated Circuits (ICs); RoHS: RoHS Compliant; Type: Audio; Part Status: Active; Dynamic Range, ADCs / DACs (db) Typ: -; Package / Case: 32-VFQFN Exposed Pad; Supplier Device Package: 32-VQFN (5x5); Packaging: Cut Tape (CT); Supplier 1: Digi-Key; Operating Temperature: -40°C ~ 85°C; ComponentLink1URL: http://www.ti.com/lit/ds/symlink/tlv320aic3110.pdf; ComponentLink1Description: http://www.ti.com/lit/ds/symlink/tlv320aic3110.pdf; Supplier Part Number 1: 296-25584-1-ND

## Sheet IO_extender.SchDoc
size A4
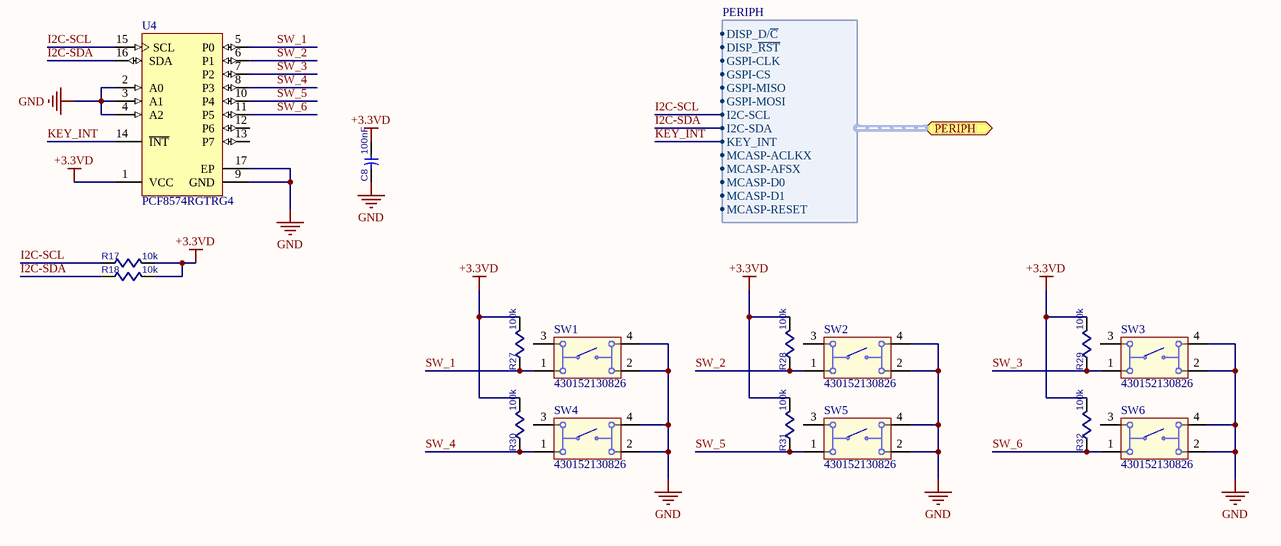
[diagram p5: IO_extender.SchDoc]

### Parts
C8  100nF  [C_0603A]
R17  10k  [R_0603]
R18  10k  [R_0603]
R27  100k  [R_0603]
R28  100k  [R_0603]
R29  100k  [R_0603]
R30  100k  [R_0603]
R31  100k  [R_0603]
R32  100k  [R_0603]
SW1  430152130826  [430152130826]
SW2  430152130826  [430152130826]
SW3  430152130826  [430152130826]
SW4  430152130826  [430152130826]
SW5  430152130826  [430152130826]
SW6  430152130826  [430152130826]
U4  PCF8574RGTRG4  [RGT16-1600X1600TP]

### Ports
PERIPH (harness PERIPH)

### Harnesses
PERIPH: DISP_D/~{C}, DISP_~{RST}, GSPI-CLK, GSPI-CS, GSPI-MISO, GSPI-MOSI, I2C-SCL, I2C-SDA, KEY_INT, MCASP-ACLKX, MCASP-AFSX, MCASP-D0, MCASP-D1, MCASP-RESET

### Nets
+3.3VD: C8.1 R17.1 R18.1 R27.1 R28.1 R29.1 R30.1 R31.1 R32.1 U4.1(VCC)  [project net IOVDD]
GND: C8.2 SW1.2 SW1.4 SW2.2 SW2.4 SW3.2 SW3.4 SW4.2 SW4.4 SW5.2 SW5.4 SW6.2 SW6.4 U4.2(A0) U4.3(A1) U4.4(A2) U4.9(GND) U4.17(EP)
I2C-SCL: R17.2 U4.15(SCL) ; port PERIPH.I2C-SCL
I2C-SDA: R18.2 U4.16(SDA) ; port PERIPH.I2C-SDA
KEY_INT: U4.14(~{INT}) ; port PERIPH.KEY_INT
SW_1: R27.2 SW1.1 U4.5(P0)
SW_2: R28.2 SW2.1 U4.6(P1)
SW_3: R29.2 SW3.1 U4.7(P2)
SW_4: R30.2 SW4.1 U4.8(P3)
SW_5: R31.2 SW5.1 U4.10(P4)
SW_6: R32.2 SW6.1 U4.11(P5)

Not connected (* = marked no-connect by the designer): SW1 3; SW2 3; SW3 3; SW4 3; SW5 3; SW6 3; U4 12(P6) 13(P7)

### Library data of the parts
C8 = C_0603: PackageReference: C_0603; VALUE: 100nF
R17 R18 R27-R32 = R_0603: PackageReference: R_0603
  R17 R18: VALUE: 10k
  R27-R32: VALUE: 100k
SW1-SW6 = CMP-1452-00011-1: WS-TASV SMD Tact Switch 6X6 mm; Manufacturer: Wuerth Elektronik; NoPins: 04; ComponentLink1Description: Manufacturer URL; ComponentLink1URL: http://www.we-online.com; PartNumber: 430152130826; ComponentLink2Description: Datasheet; PackageReference: 430152130826; ComponentLink2URL: http://katalog.we-online.de/em/datasheet/4301x2.pdf
U4 = CMP-0314-00047-1: Remote 8-Bit I/O Expander for I2C-Bus, 2.5 to 6 V, -40 to 85 degC, 16-pin QFN (RGT), Green (RoHS & no Sb/Br); Manufacturer: Texas Instruments; # of I/Os: 8; VCC(Max)(V): 6; I2C Address: 0100 xxx; Vcc range(V): 2.5 to 6.0; Push-Pull I/O Type: Yes; Max Frequency(kHz): 100; VCC(Min)(V): 2.5; fSCLK(Max)(MHz): 0.1; SubFamily: I2C IO Expander; Voltage Nodes(V): 5, 3.3; Code_JEDEC: MO-220; PackageReference: RGT16-1600X1600TP; DatasheetVersion: SCPS068G; ComponentLink1URL: http://www.ti.com/general/docs/lit/getliterature.tsp?genericPartNumber=PCF8574&fileType=pdf; PackageVersion: revH, Oct-2011; PartNumber: PCF8574RGTRG4; PackageDescription: 16-Pin Plastic Quad Flatpack No-Lead, 3 x 3 mm Body, 0.5 mm Pitch; Eco-Plan: Green (RoHS & no Sb/Br); Mounting Technology: Surface Mount; Interrupt Output: Yes; ComponentLink2URL: http://www.ti.com/litv/pdf/mpds006c; Reset Input: No; ComponentLink1Description: Datasheet; ComponentLink2Description: Package Specification

## Sheet Power.SchDoc
size A4
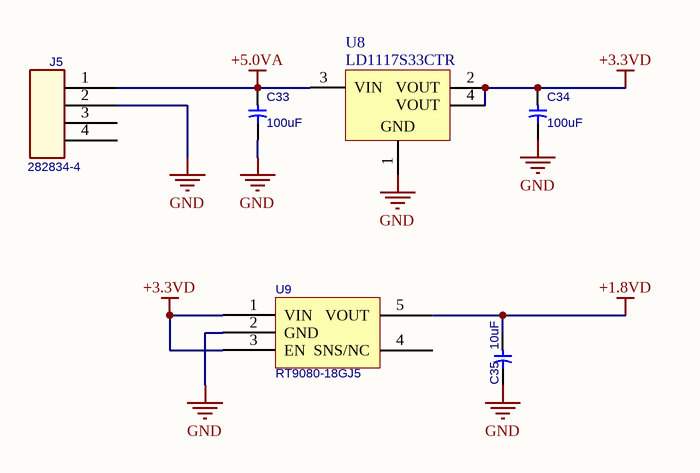
[diagram p6: Power.SchDoc]

### Parts
C33  100uF  [C_1210D]
C34  100uF  [C_1210D]
C35  10uF  [C_0603A]
J5  282834-4  [HEADER_2.54_SCREW_4PIN]
U8  LD1117S33CTR  [SOT-223_N]
U9  RT9080-18GJ5  [SOT95P275X100-5N]

### Nets
+1.8VD: C35.1 U9.5(VOUT)  [project net DVDD]
+3.3VD: C34.1 U8.2(VOUT) U8.4(VOUT) U9.1(VIN) U9.3(EN)  [project net IOVDD]
+5.0VA: C33.1 J5.1 U8.3(VIN)  [project net SPLVDD]
GND: C33.2 C34.2 C35.2 J5.2 U8.1(GND) U9.2(GND)

Not connected (* = marked no-connect by the designer): J5 3 4; U9 4(SNS/NC)

### Library data of the parts
C33 C34 = C_1210: PackageReference: C_1210; VALUE: 100uF
C35 = C_0603: PackageReference: C_0603; VALUE: 10uF
J5 = TERM_LIST_4: as J4 on sheet AUDIO_DAC; Supplier 1: Farnell; Contact Material: Brass; Contact Plating: Tin Plated Contacts<!--FANDB--><div class="features-and-benefits-container"><div class="features-and-benefits-description"><span class="features-benefits-value">The 282834-4 is a 4-position 1-row green through-hole right-angle Terminal Block with tin-plated brass contacts and polyamide 6.6 housing. The BUCHANAN terminal block with special rising cage clamp design allows numerous reliable connections and disconnections at field installations. The housing funnel entry design enables an easier product application.</span></div><div class="features-and-benefits-list"><ul class="features-and-benefits-list-list"><li class="features-and-benefits-list-item">IR Reflow compatible</li><li class="features-and-benefits-list-item">-40 to +105; Manufacturer Part Number: 282834-4; Product Range: -; RoHS: YES; ComponentLink1URL: http://www.farnell.com/cad/1605505.pdf; ComponentLink1Description: http://www.farnell.com/cad/1605505.pdf; ComponentLink2URL: http://www.farnell.com/datasheets/1650926.pdf; ComponentLink2Description: http://www.farnell.com/datasheets/1650926.pdf; ComponentLink3URL: http://www.farnell.com/datasheets/504548.pdf; ComponentLink3Description: http://www.farnell.com/datasheets/504548.pdf; Supplier Part Number 1: 2396253
U8 = CMP-0244-00307-1: Fixed Low Drop Positive Voltage Regulator, 3.3V, 4-Pin SOT-223, Tape and Reel; ComponentLink1URL: http://www.st.com; PackageVersion: 2010; ComponentLink1Description: Manufacturer URL; DatasheetVersion: 1/11/2011; ComponentLink2URL: http://www.st.com/internet/com/TECHNICAL_RESOURCES/TECHNICAL_LITERATURE/DATASHEET/CD00000544.pdf; PackageReference: SOT-223; ComponentLink2Description: Datasheet; PackageDescription: 4-Pin SOT-223 Package, 6.5 x 3.5 mm Body, 2.3 mm Pitch, 7 mm Lead Span
U9 = RT9080-18GJ5: LDO 1.8V, 600mA; Manufacturer: Richtek USA Inc.; Regulator Topology: Positive Fixed; Voltage - Input: Up to 5.5V; Voltage - Dropout (Typical): 0.57V @ 600mA; Number of Regulators: 1; Current - Limit (Min): 610mA; RoHS: RoHS Compliant; Package / Case: SOT-23-5 Thin, TSOT-23-5; Supplier 1: Digi-Key; Category: Integrated Circuits (ICs); Operating Temperature: -40°C ~ 85°C; Packaging: Cut Tape (CT); Part Status: Active; Current - Output: 600mA; Voltage - Output: 1.8V; Manufacturer Part Number: RT9080-18GJ5; Mounting Type: Surface Mount; Supplier Device Package: TSOT-23-5; ComponentLink1URL: http://www.richtek.com/assets/product_file/RT9080/DS9080-00.pdf; ComponentLink1Description: http://www.richtek.com/assets/product_file/RT9080/DS9080-00.pdf; Supplier Part Number 1: RT9080-18GJ5CT-ND

## Nets that join several sheets
DVDD: AUDIO_DAC (C42.1 C43.1 U7.3), Power (C35.1 U9.5)
GND: Microcontroller (36 pins), FT232 (17 pins), Display (12 pins), AUDIO_DAC (6 pins), IO_extender (18 pins), Power (6 pins)
IOVDD: Microcontroller (18 pins), FT232 (13 pins), Display (C30.1 C31.1 DS1.2), AUDIO_DAC (C46.1 C47.1 FIL3.1 U7.2), IO_extender (10 pins), Power (5 pins)
SPLVDD: AUDIO_DAC (6 pins), Power (C33.1 J5.1 U8.3)
CC_NRST: Microcontroller (C14.1 R19.2 U5.32), FT232 (R6.1)
CC_TCK: Microcontroller (U5.19), FT232 (R2.1)
CC_TDI: Microcontroller (U5.17), FT232 (R3.1)
CC_TDO: Microcontroller (U5.16), FT232 (R4.1)
CC_TMS: Microcontroller (U5.20), FT232 (R5.1)
DISP_D/~{C}: Microcontroller (U5.64), Display (DS1.4)
DISP_~{RST}: Microcontroller (U5.2), Display (DS1.16)
GSPI-CLK: Microcontroller (U5.5), Display (DS1.7)
GSPI-CS: Microcontroller (U5.8), Display (DS1.17)
GSPI-MOSI: Microcontroller (U5.7), Display (DS1.8)
I2C-SCL: Microcontroller (U5.3), AUDIO_DAC (U7.10), IO_extender (R17.2 U4.15)
I2C-SDA: Microcontroller (U5.4), AUDIO_DAC (U7.9), IO_extender (R18.2 U4.16)
KEY_INT: Microcontroller (U5.1), IO_extender (U4.14)
McASP-ACLKX: Microcontroller (U5.62), AUDIO_DAC (U7.7)
McASP-AFSX: Microcontroller (U5.45), AUDIO_DAC (U7.6)
McASP-D1: Microcontroller (U5.50), AUDIO_DAC (U7.5)
McASP-RESET: Microcontroller (U5.63), AUDIO_DAC (U7.31)
UART0_RX: Microcontroller (U5.57), FT232 (R10.1)
UART0_TX: Microcontroller (U5.55), FT232 (R11.1)